# Altium schematic sheet S67_01_0333.SchDoc
size A4
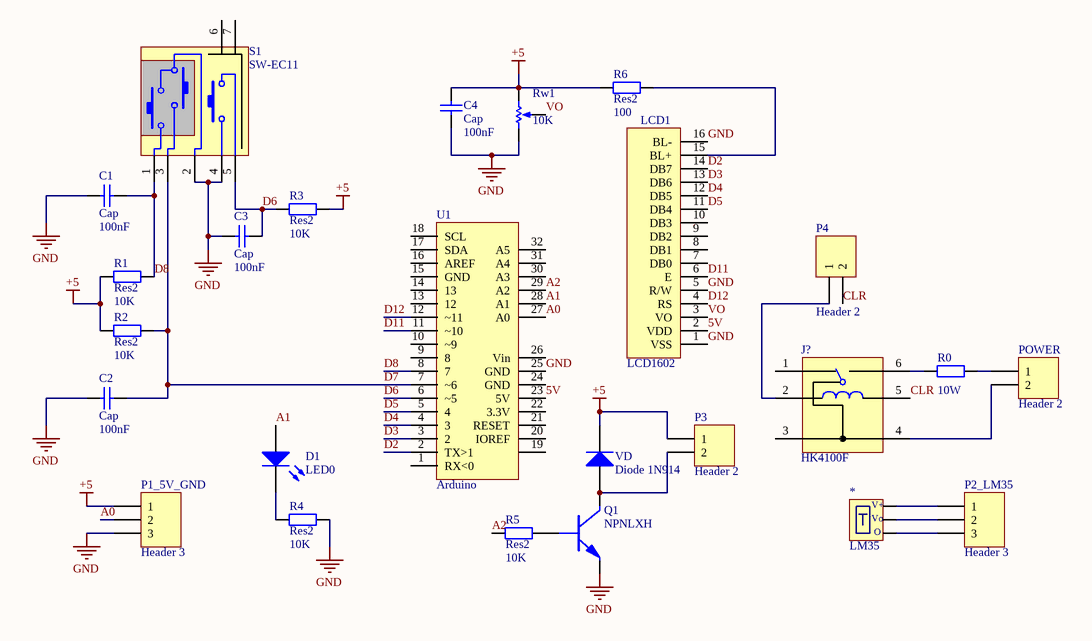
[diagram p0: S67_01_0333.SchDoc]

## Parts
*  LM35  [LM35]
C1  Cap  value 100nF  [RAD-0.2]
C2  Cap  value 100nF  [RAD-0.2]
C3  Cap  value 100nF  [RAD-0.2]
C4  Cap  value 100nF  [RAD-0.2]
D1  LED0  [LEDLXH-5]
J?  HK4100F  [HK4100F]
LCD1  LCD1602  [LCD1602]
P1_5V_GND  Header 3  [SIP-3]
P2_LM35  Header 3  [SIP-3]
P3  Header 2  [SIP-2]
P4  Header 2  [SIP-2]
POWER  Header 2  [POWER PLUG2]
Q1  NPNLXH  [NPN]
R0  value 10W  [AXIAL4cm]
R1  Res2  value 10K  [AXIAL-0.4]
R2  Res2  value 10K  [AXIAL-0.4]
R3  Res2  value 10K  [AXIAL-0.4]
R4  Res2  value 10K  [AXIAL-0.4]
R5  Res2  value 10K  [AXIAL-0.4]
R6  Res2  value 100  [AXIAL-0.4]
Rw1  value 10K  [VR5]
S1  SW-EC11  [EC11]
U1  Arduino  [Arduino-UNO]
VD  Diode 1N914  [DIODE-0.4]

## Nets
+5: C4.1 P1_5V_GND.1 P3.1 R1.2 R2.2 R3.1 R6.2 Rw1.2(BOT) VD.2(K)
GND: C1.2 C2.2 C3.1 C4.2 LCD1.1(VSS) LCD1.5(R/W) LCD1.16(BL-) P1_5V_GND.3 Q1.1(E) R4.1 Rw1.1(TOP) S1.2 S1.4 U1.25(GND)
5V: LCD1.2(VDD) U1.23(5V)
A0: P1_5V_GND.2 U1.27(A0)
A1: D1.1(A) U1.28(A1)
A2: R5.2 U1.29(A2)
CLR: J?.5 P4.2
D2: LCD1.14(DB7) U1.2(TX>1)
D3: LCD1.13(DB6) U1.3(2)
D4: LCD1.12(DB5) U1.4(3)
D5: LCD1.11(DB4) U1.5(4)
D6: C3.2 R3.2 S1.5 U1.6(~5)
D7: C2.1 R2.1 S1.3 U1.7(~6)
D8: C1.1 R1.1 S1.1 U1.8(7)
D11: LCD1.6(E) U1.11(~10)
D12: LCD1.4(RS) U1.12(~11)
VO: LCD1.3(VO) Rw1.3(TAP)
Net*_1: *.1 P2_LM35.1
Net*_2: *.2 P2_LM35.2
Net*_3: *.3 P2_LM35.3
NetD1_2: D1.2(K) R4.2
NetJ?_2: J?.2 P4.1
NetJ?_4: J?.4 POWER.2
NetJ?_6: J?.6 R0.2
NetLCD1_15: LCD1.15(BL+) R6.1
NetP3_2: P3.2 Q1.3(C) VD.1(A)
NetPOWER_1: POWER.1 R0.1
NetQ1_2: Q1.2(B) R5.1

Not connected (* = marked no-connect by the designer): J? 1 3; LCD1 7(DB0) 8(DB1) 9(DB2) 10(DB3); S1 6 7; U1 1(RX<0) 9(8) 10(~9) 13(12) 14(13) 15(GND) 16(AREF) 17(SDA) 18(SCL) 19 20(IOREF) 21(RESET) 22(3.3V) 24(GND) 26(Vin) 30(A3) 31(A4) 32(A5)

## Notes on the sheet
- (in symbol LM35) V+; Vo; O

## Library data of the parts
* = LM35: LM35温度传感器
C1-C4 = Cap: Capacitor; Published: 8-Jun-2000; LatestRevisionDate: 17-Jul-2002; LatestRevisionNote: Re-released for DXP Platform.; PackageReference: RAD-0.3; Publisher: Altium Limited
D1 = LED0: Typical INFRARED GaAs LED; Published: 8-Jun-2000; LatestRevisionDate: 08-Jul-2005; LatestRevisionNote: Mech Layer 1 removed.; PackageReference: LED-0; Publisher: Altium Limited
J? = HK4100F: 单刀双掷继电器
LCD1 = LCD1602: 液晶屏
P1_5V_GND P2_LM35 = Header 3: Header, 3-Pin; LatestRevisionDate: 17-Jul-2002; LatestRevisionNote: Re-released for DXP Platform.; Publisher: Altium Limited
P3 P4 POWER = Header 2: Header, 2-Pin; LatestRevisionDate: 17-Jul-2002; LatestRevisionNote: Re-released for DXP Platform.; Publisher: Altium Limited
Q1 = NPNLXH: NPN Transistor
R0-R6 = Res2: Resistor; Published: 8-Jun-2000; LatestRevisionDate: 17-Jul-2002; LatestRevisionNote: Re-released for DXP Platform.; PackageReference: AXIAL-0.4; Publisher: Altium Limited
Rw1 = RPot: Potentiometer; Sim Note: Enter the Resistance value and the set point into parameter fields.; Set Position: 0.5; Published: 8-Jun-2000; LatestRevisionDate: 17-Jul-2002; LatestRevisionNote: Re-released for DXP Platform.; PackageReference: VR5; Publisher: Altium Limited
S1 = SW-EC11: 旋转编码开关; Published: 24-Mar-1999; LatestRevisionDate: 17-Jul-2002; LatestRevisionNote: Re-released for DXP Platform.; PackageReference: SPST-2; Publisher: Altium Limited
U1 = Arduino-UNO
VD = Diode 1N914: High Conductance Fast Diode; Published: 8-Jun-2000; LatestRevisionDate: 17-Jul-2002; LatestRevisionNote: Re-released for DXP Platform.; DatasheetDocument: 1997; PackageReference: DO-35; Publisher: Altium Limited; Code_JEDEC: DO-204-AH; ComponentLink1Description: Manufacturer Link; ComponentLink1URL: http://www.fairchildsemi.com/; ComponentLink2Description: Datasheet; ComponentLink2URL: http://www.fairchildsemi.com/ds/1N%2F1N4448.pdf